# Altium project GSMMHM.PrjPcb
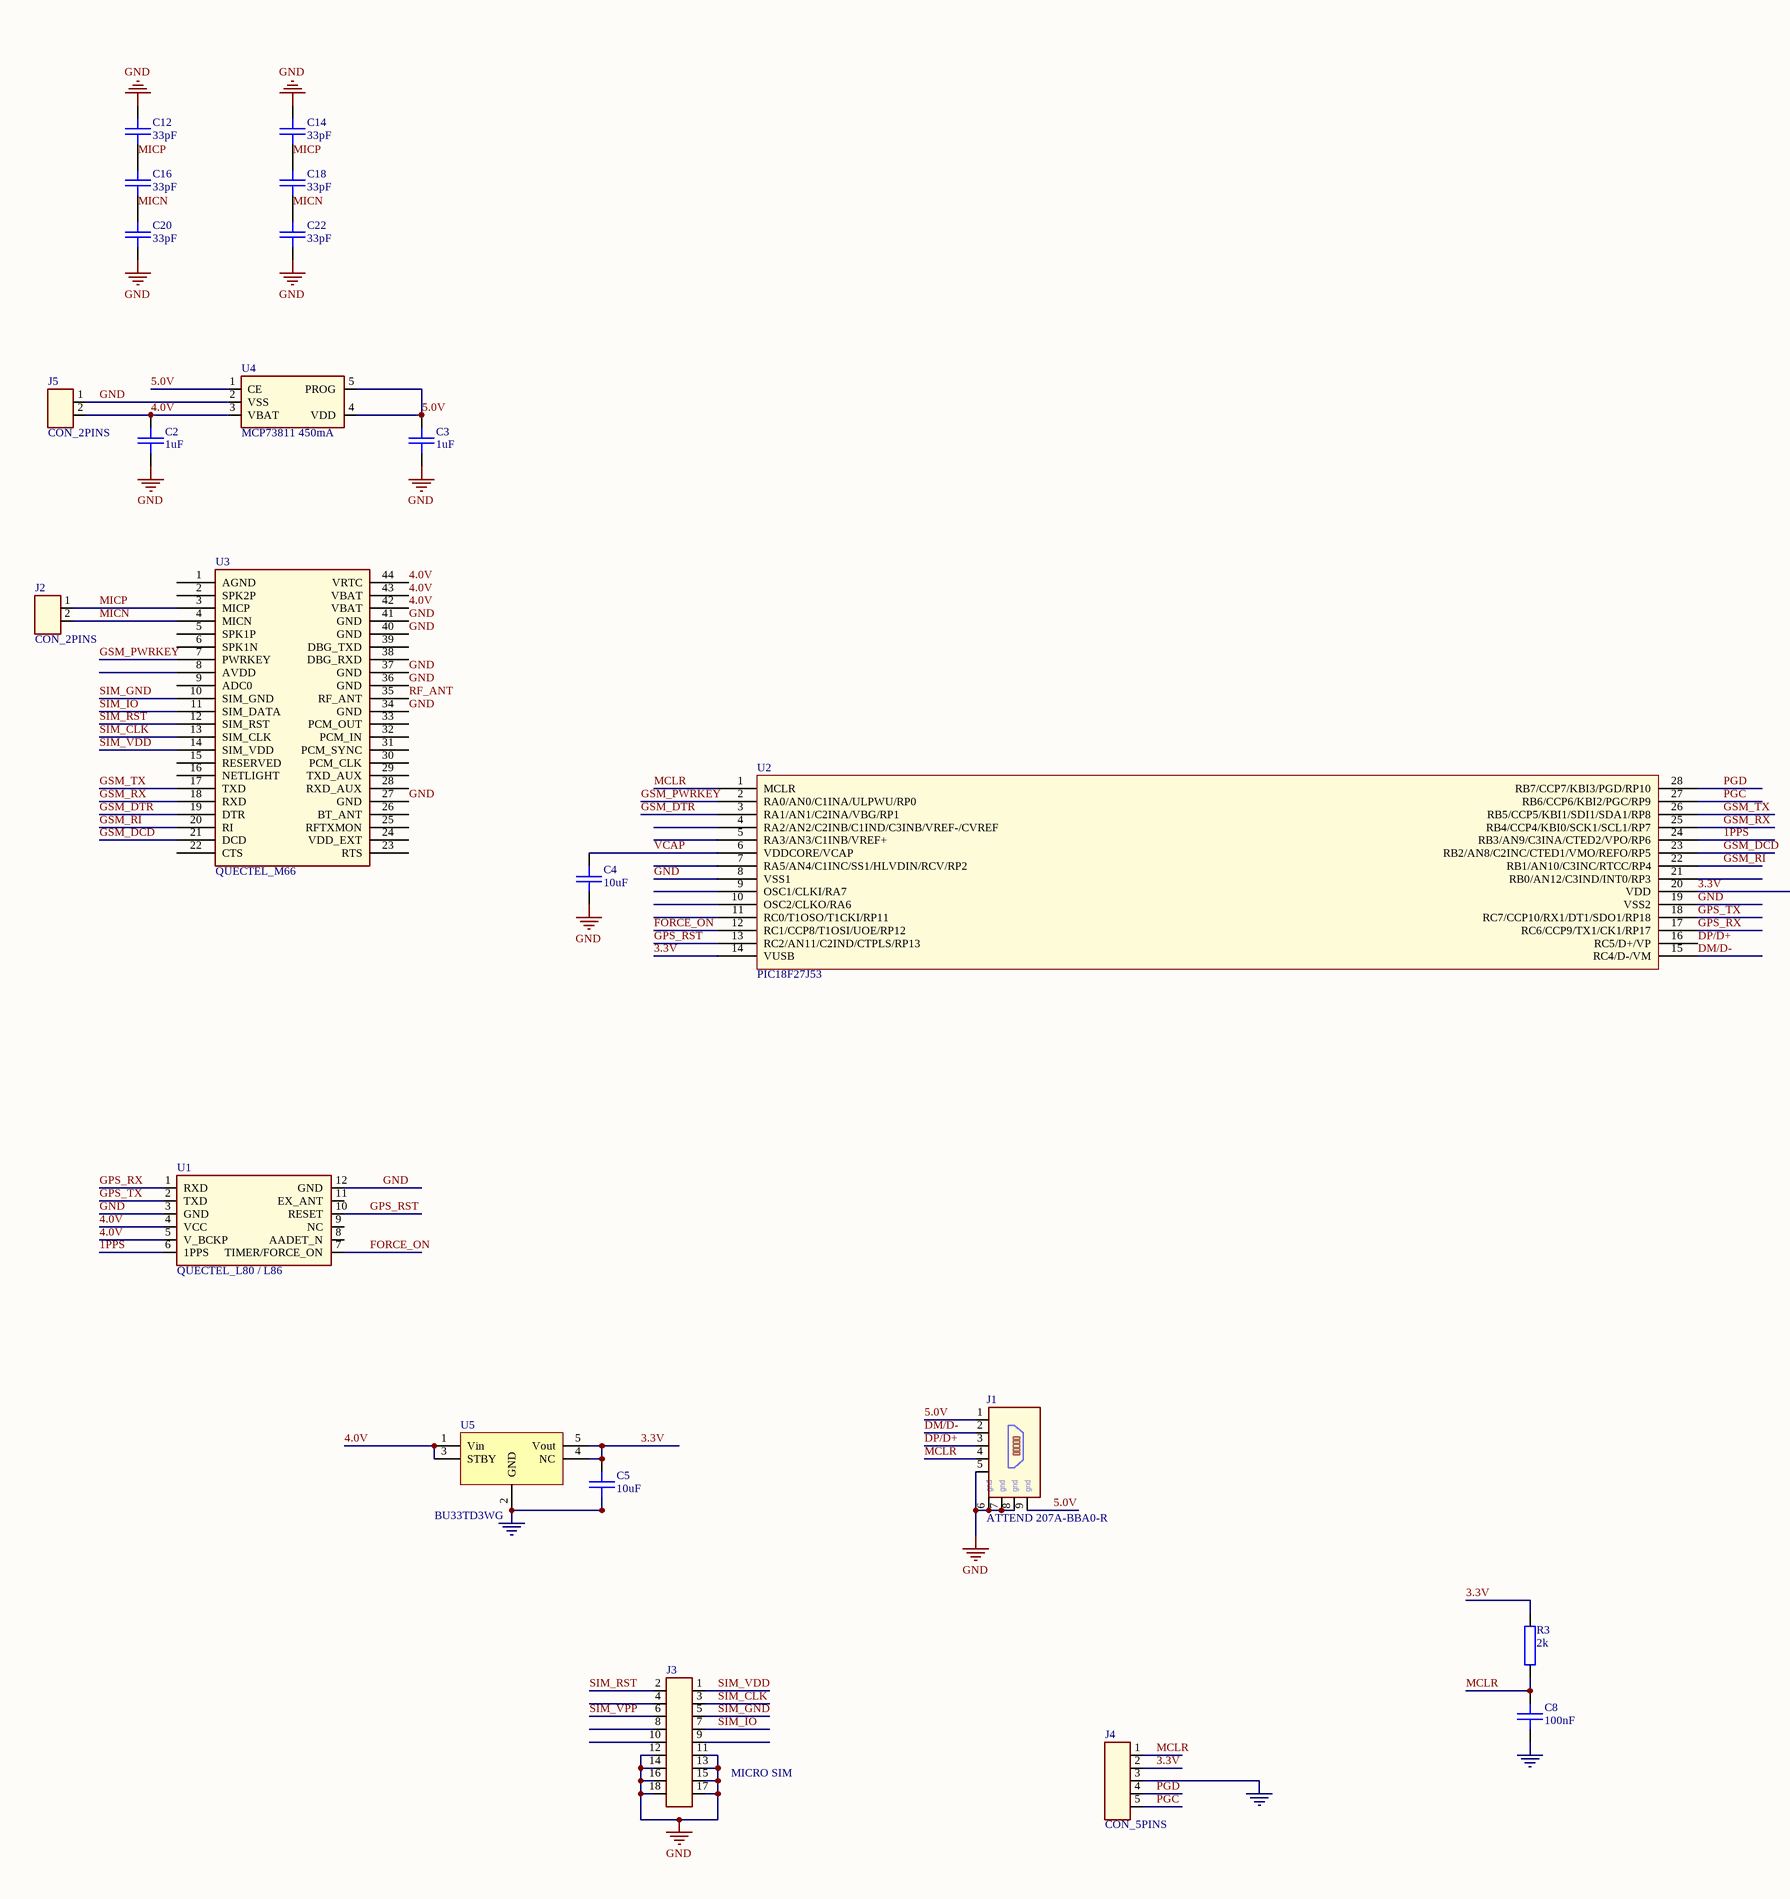
[diagram p0: GSMMHM.SchDoc, left]
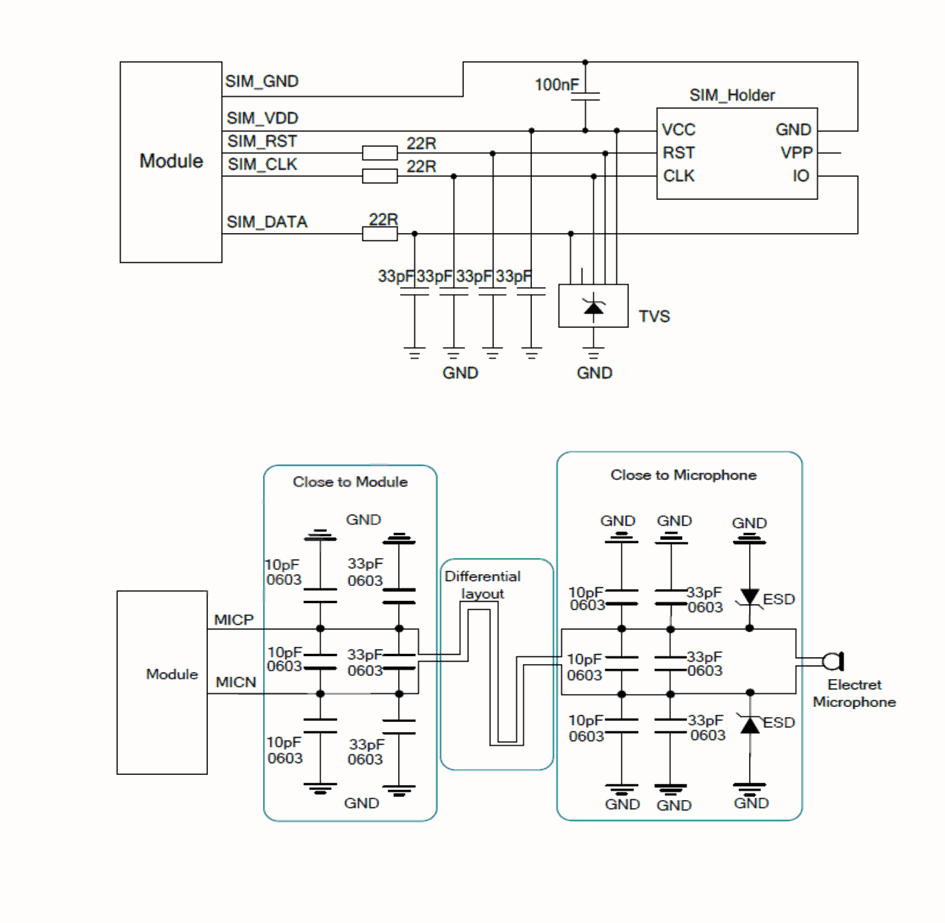
[diagram p1: GSMMHM.SchDoc, right]
1 sheet, 22 parts. Net scope: global (net labels, ports and power ports of the same name join across sheets).
Board file: GSMMHM.PcbDoc

## Sheet GSMMHM.SchDoc
size A2

### Parts
C2  1uF  [SMD_0603_CAPC1608X95N]
C3  1uF  [SMD_0603_CAPC1608X95N]
C4  10uF  [SMD_0805_CAPC2012X95N]
C5  10uF  [SMD_0805_CAPC2012X95N]
C8  100nF  [SMD_0603_CAPC1608X95N]
C12  33pF  [SMD_0603_CAPC1608X95N]
C14  33pF  [SMD_0603_CAPC1608X95N]
C16  33pF  [SMD_0603_CAPC1608X95N]
C18  33pF  [SMD_0603_CAPC1608X95N]
C20  33pF  [SMD_0603_CAPC1608X95N]
C22  33pF  [SMD_0603_CAPC1608X95N]
J1  ATTEND 207A-BBA0-R  [SMD_CON_MICRO_USB]
J2  CON_2PINS  [PTH_MIC_6MM_2.7MM_PITCH1.9]
J3  MICRO SIM  [SMD_CON-WURTH_MICRO_SIM_693021010811]
J4  CON_5PINS  [SIP5 - PGM]
J5  CON_2PINS  [PTH_HDRV02W64P254_1X02]
R3  2k  [SMD_0603_RESC1608X55N]
U1  QUECTEL_L80 / L86  [SMD_MOD_L80_SOIC254P1600X1600-12N]
U2  PIC18F27J53  [SMD_SOP65P780X200-28N]
U3  QUECTEL_M66  [SMD_MOD_M66-44N]
U4  MCP73811 450mA  [SMD_SOT26_SOT95P285X140-5N - DLV]
U5  BU33TD3WG  [SMD_SOT26_SOT95P285X140-5N - DLV]

### Nets
GND: C2.2 C3.2 C4.2 C5.2 C8.2 C12.1 C14.1 C20.2 C22.2 J1.5 J1.6 J1.7 J1.8 J3.11 J3.12 J3.13 J3.14 J3.15 J3.16 J3.17 J3.18 J4.3 J5.1 U1.3(GND) U1.12(GND) U2.8(VSS1) U2.19(VSS2) U3.27(GND) U3.34(GND) U3.36(GND) U3.37(GND) U3.40(GND) U3.41(GND) U4.2(VSS) U5.2(GND)
1PPS: U1.6(1PPS) U2.24(RB3/AN9/C3INA/CTED2/VPO/RP6)
3.3V: C5.1 J4.2 R3.1 U2.14(VUSB) U2.20(VDD) U5.4(NC) U5.5(Vout)
4.0V: C2.1 J5.2 U1.4(VCC) U1.5(V_BCKP) U3.42(VBAT) U3.43(VBAT) U3.44(VRTC) U4.3(VBAT) U5.1(Vin) U5.3(STBY)
5.0V: C3.1 J1.1 J1.9 U4.1(CE) U4.4(VDD) U4.5(PROG)
DM/D-: J1.2 U2.15(RC4/D-/VM)
DP/D+: J1.3 U2.16(RC5/D+/VP)
FORCE_ON: U1.7(TIMER/FORCE_ON) U2.12(RC1/CCP8/T1OSI/UOE/RP12)
GPS_RST: U1.10(RESET) U2.13(RC2/AN11/C2IND/CTPLS/RP13)
GPS_RX: U1.1(RXD) U2.17(RC6/CCP9/TX1/CK1/RP17)
GPS_TX: U1.2(TXD) U2.18(RC7/CCP10/RX1/DT1/SDO1/RP18)
GSM_DCD: U2.23(RB2/AN8/C2INC/CTED1/VMO/REFO/RP5) U3.21(DCD)
GSM_DTR: U2.3(RA1/AN1/C2INA/VBG/RP1) U3.19(DTR)
GSM_PWRKEY: U2.2(RA0/AN0/C1INA/ULPWU/RP0) U3.7(PWRKEY)
GSM_RI: U2.22(RB1/AN10/C3INC/RTCC/RP4) U3.20(RI)
GSM_RX: U2.25(RB4/CCP4/KBI0/SCK1/SCL1/RP7) U3.18(RXD)
GSM_TX: U2.26(RB5/CCP5/KBI1/SDI1/SDA1/RP8) U3.17(TXD)
MCLR: C8.1 J1.4 J4.1 R3.2 U2.1(MCLR)
MICN: C16.2 C18.2 C20.1 C22.1 J2.2 U3.4(MICN)
MICP: C12.2 C14.2 C16.1 C18.1 J2.1 U3.3(MICP)
PGC: J4.5 U2.27(RB6/CCP6/KBI2/PGC/RP9)
PGD: J4.4 U2.28(RB7/CCP7/KBI3/PGD/RP10)
RF_ANT: U3.35(RF_ANT)
SIM_CLK: J3.3 U3.13(SIM_CLK)
SIM_GND: J3.5 U3.10(SIM_GND)
SIM_IO: J3.7 U3.11(SIM_DATA)
SIM_RST: J3.2 U3.12(SIM_RST)
SIM_VDD: J3.1 U3.14(SIM_VDD)
SIM_VPP: J3.6
VCAP: C4.1 U2.6(VDDCORE/VCAP)

Not connected (* = marked no-connect by the designer): J3 4 8 9 10; U1 8(AADET_N) 9(NC) 11(EX_ANT); U2 4(RA2/AN2/C2INB/C1IND/C3INB/VREF-/CVREF) 5(RA3/AN3/C1INB/VREF+) 7(RA5/AN4/C1INC/SS1/HLVDIN/RCV/RP2) 9(OSC1/CLKI/RA7) 10(OSC2/CLKO/RA6) 11(RC0/T1OSO/T1CKI/RP11) 21(RB0/AN12/C3IND/INT0/RP3); U3 1(AGND) 2(SPK2P) 5(SPK1P) 6(SPK1N) 8(AVDD) 9(ADC0) 15(RESERVED) 16(NETLIGHT) 22(CTS) 23(RTS) 24(VDD_EXT) 25(RFTXMON) 26(BT_ANT) 28(RXD_AUX) 29(TXD_AUX) 30(PCM_CLK) 31(PCM_SYNC) 32(PCM_IN) 33(PCM_OUT) 38(DBG_RXD) 39(DBG_TXD)

### Notes on the sheet
- (in symbol CON_USB_MINI) gnd

### Library data of the parts
C2-C5 C8 C12 C14 C16 C18 C20 C22 = C: NOTE: <NOTE>
J1 = CON_USB_MINI: NOTE: <NOTE>
J2 J5 = CON_2PINS: NOTE: <NOTE>
J3 = CON_2ROWS_18PINS
J4 = CON_5PINS: NOTE: <NOTE>
R3 = R: NOTE: <NOTE>; R_BDS: R
U1 = MOD_QUECTEL_L80_L86
U2 = IC_PIC18F27J53
U3 = MOD_QUECTEL_M66
U4 = IC_MCP73812: MCP73812; DB_PART_NUMBER: PSU000000127; DB_PART_TYPE: Linear Voltage Regulator; DB_MANUFACTURER_PART: ROHM        BD33KA5WF-E2; DB_T_RANGE: -40 to 105; DB_VOLTAGE: 3.3V; DB_CURRENT: 500mA; DB_PACKAGE: SOIC-8; DB_DESCRIPTION: IC BD33KA5WF-E2 SOIC-8; DB_PCB_DEVICE: SMD_SOIC127P620X160-8N; DB_CERTIFIED: ISHIDDEN=T; DB_APPROVED_BY: VSN; DB_APPROVED_ON: 07.5.2014 г. 13:18:28; DB_STATUS: NEW; DB_DATASHEET: http://john.epiqdesign.com/projects/CIS_Datasheets/IC_bdxxka5wf-e-209388.pdf?rev=1408&sc=0
U5 = IC_BU33TD3WG

## Assembly variants
Production: not fitted Q1 Q2